# Altium schematic sheet Display.SchDoc
size B portrait
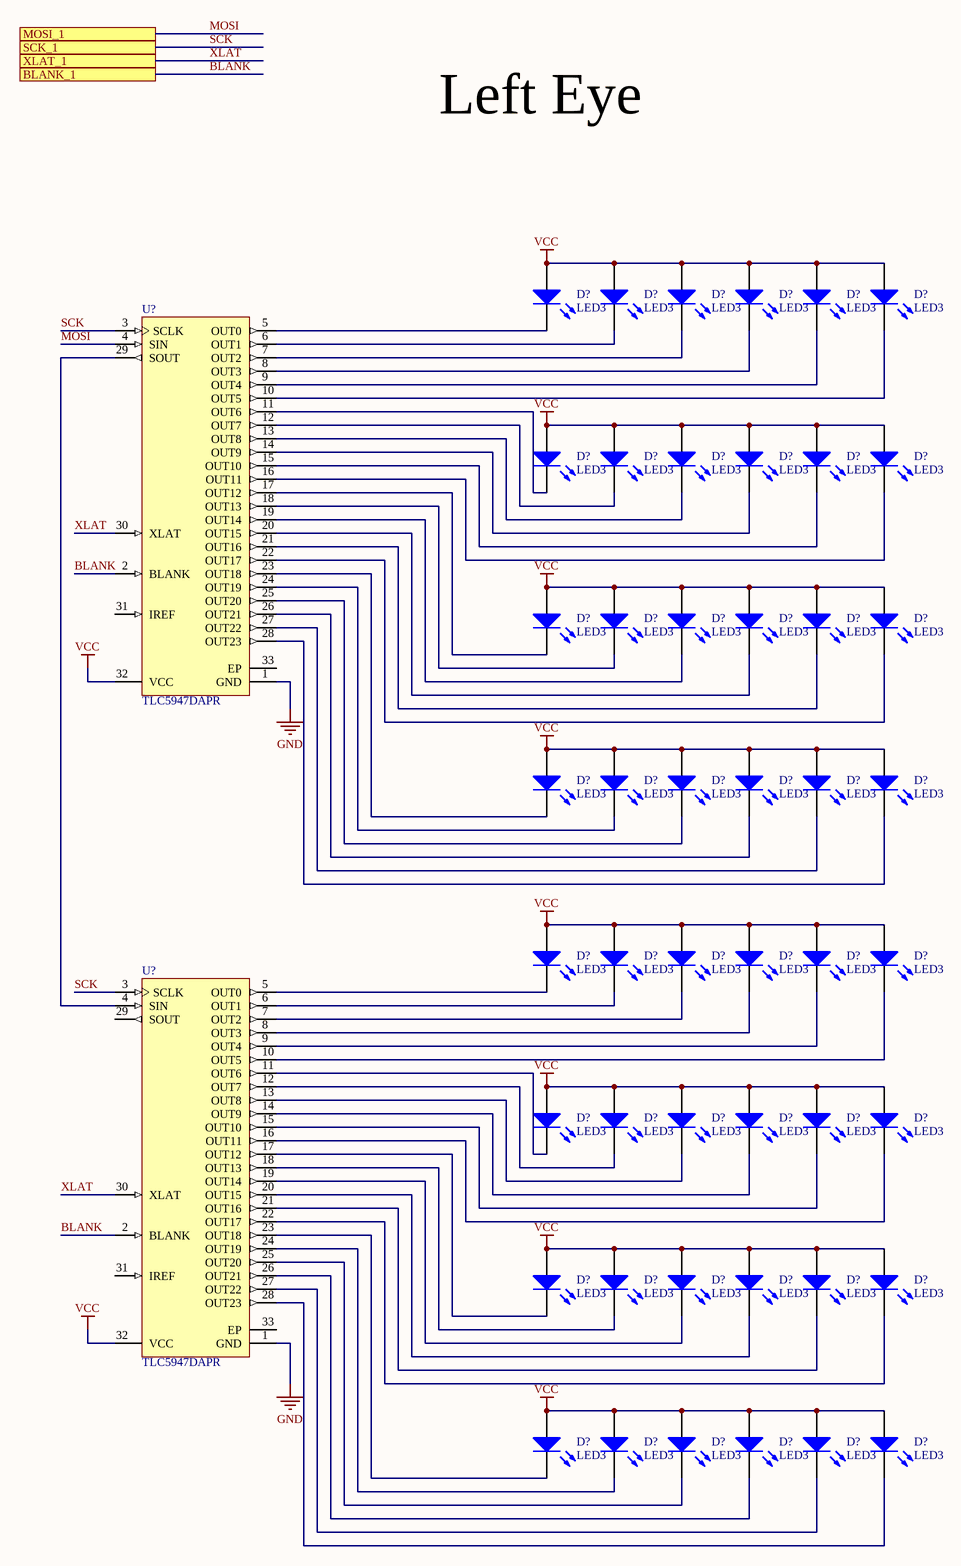
[diagram p0: Display.SchDoc]

## Parts
(Parts that share a designator on the sheet are numbered #1, #2 ... from top to bottom, then left to right.)
D?#1  LED3  [3.5X2.8X1.9]
D?#2  LED3  [3.5X2.8X1.9]
D?#3  LED3  [3.5X2.8X1.9]
D?#4  LED3  [3.5X2.8X1.9]
D?#5  LED3  [3.5X2.8X1.9]
D?#6  LED3  [3.5X2.8X1.9]
D?#7  LED3  [3.5X2.8X1.9]
D?#8  LED3  [3.5X2.8X1.9]
D?#9  LED3  [3.5X2.8X1.9]
D?#10  LED3  [3.5X2.8X1.9]
D?#11  LED3  [3.5X2.8X1.9]
D?#12  LED3  [3.5X2.8X1.9]
D?#13  LED3  [3.5X2.8X1.9]
D?#14  LED3  [3.5X2.8X1.9]
D?#15  LED3  [3.5X2.8X1.9]
D?#16  LED3  [3.5X2.8X1.9]
D?#17  LED3  [3.5X2.8X1.9]
D?#18  LED3  [3.5X2.8X1.9]
D?#19  LED3  [3.5X2.8X1.9]
D?#20  LED3  [3.5X2.8X1.9]
D?#21  LED3  [3.5X2.8X1.9]
D?#22  LED3  [3.5X2.8X1.9]
D?#23  LED3  [3.5X2.8X1.9]
D?#24  LED3  [3.5X2.8X1.9]
D?#25  LED3  [3.5X2.8X1.9]
D?#26  LED3  [3.5X2.8X1.9]
D?#27  LED3  [3.5X2.8X1.9]
D?#28  LED3  [3.5X2.8X1.9]
D?#29  LED3  [3.5X2.8X1.9]
D?#30  LED3  [3.5X2.8X1.9]
D?#31  LED3  [3.5X2.8X1.9]
D?#32  LED3  [3.5X2.8X1.9]
D?#33  LED3  [3.5X2.8X1.9]
D?#34  LED3  [3.5X2.8X1.9]
D?#35  LED3  [3.5X2.8X1.9]
D?#36  LED3  [3.5X2.8X1.9]
D?#37  LED3  [3.5X2.8X1.9]
D?#38  LED3  [3.5X2.8X1.9]
D?#39  LED3  [3.5X2.8X1.9]
D?#40  LED3  [3.5X2.8X1.9]
D?#41  LED3  [3.5X2.8X1.9]
D?#42  LED3  [3.5X2.8X1.9]
D?#43  LED3  [3.5X2.8X1.9]
D?#44  LED3  [3.5X2.8X1.9]
D?#45  LED3  [3.5X2.8X1.9]
D?#46  LED3  [3.5X2.8X1.9]
D?#47  LED3  [3.5X2.8X1.9]
D?#48  LED3  [3.5X2.8X1.9]
U?#1  TLC5947DAPR  [DAP0032A_L]
U?#2  TLC5947DAPR  [DAP0032A_L]

## Ports
BLANK_1, MOSI_1, SCK_1, XLAT_1

## Nets
GND: U?#1.1(GND) U?#2.1(GND)
VCC: D?#1.1(A) D?#2.1(A) D?#3.1(A) D?#4.1(A) D?#5.1(A) D?#6.1(A) D?#7.1(A) D?#8.1(A) D?#9.1(A) D?#10.1(A) D?#11.1(A) D?#12.1(A) D?#13.1(A) D?#14.1(A) D?#15.1(A) D?#16.1(A) D?#17.1(A) D?#18.1(A) D?#19.1(A) D?#20.1(A) D?#21.1(A) D?#22.1(A) D?#23.1(A) D?#24.1(A) D?#25.1(A) D?#26.1(A) D?#27.1(A) D?#28.1(A) D?#29.1(A) D?#30.1(A) D?#31.1(A) D?#32.1(A) D?#33.1(A) D?#34.1(A) D?#35.1(A) D?#36.1(A) D?#37.1(A) D?#38.1(A) D?#39.1(A) D?#40.1(A) D?#41.1(A) D?#42.1(A) D?#43.1(A) D?#44.1(A) D?#45.1(A) D?#46.1(A) D?#47.1(A) D?#48.1(A) U?#1.32(VCC) U?#2.32(VCC)
BLANK: U?#1.2(BLANK) U?#2.2(BLANK) ; port BLANK_1
MOSI: U?#1.4(SIN) ; port MOSI_1
SCK: U?#1.3(SCLK) U?#2.3(SCLK) ; port SCK_1
XLAT: U?#1.30(XLAT) U?#2.30(XLAT) ; port XLAT_1
NetD?#1_2: D?#1.2(K) U?#1.5(OUT0)
NetD?#2_2: D?#2.2(K) U?#1.6(OUT1)
NetD?#3_2: D?#3.2(K) U?#1.7(OUT2)
NetD?#4_2: D?#4.2(K) U?#1.8(OUT3)
NetD?#5_2: D?#5.2(K) U?#1.9(OUT4)
NetD?#6_2: D?#6.2(K) U?#1.10(OUT5)
NetD?#7_2: D?#7.2(K) U?#1.11(OUT6)
NetD?#8_2: D?#8.2(K) U?#1.12(OUT7)
NetD?#9_2: D?#9.2(K) U?#1.13(OUT8)
NetD?#10_2: D?#10.2(K) U?#1.14(OUT9)
NetD?#11_2: D?#11.2(K) U?#1.15(OUT10)
NetD?#12_2: D?#12.2(K) U?#1.16(OUT11)
NetD?#13_2: D?#13.2(K) U?#1.17(OUT12)
NetD?#14_2: D?#14.2(K) U?#1.18(OUT13)
NetD?#15_2: D?#15.2(K) U?#1.19(OUT14)
NetD?#16_2: D?#16.2(K) U?#1.20(OUT15)
NetD?#17_2: D?#17.2(K) U?#1.21(OUT16)
NetD?#18_2: D?#18.2(K) U?#1.22(OUT17)
NetD?#19_2: D?#19.2(K) U?#1.23(OUT18)
NetD?#20_2: D?#20.2(K) U?#1.24(OUT19)
NetD?#21_2: D?#21.2(K) U?#1.25(OUT20)
NetD?#22_2: D?#22.2(K) U?#1.26(OUT21)
NetD?#23_2: D?#23.2(K) U?#1.27(OUT22)
NetD?#24_2: D?#24.2(K) U?#1.28(OUT23)
NetD?#25_2: D?#25.2(K) U?#2.5(OUT0)
NetD?#26_2: D?#26.2(K) U?#2.6(OUT1)
NetD?#27_2: D?#27.2(K) U?#2.7(OUT2)
NetD?#28_2: D?#28.2(K) U?#2.8(OUT3)
NetD?#29_2: D?#29.2(K) U?#2.9(OUT4)
NetD?#30_2: D?#30.2(K) U?#2.10(OUT5)
NetD?#31_2: D?#31.2(K) U?#2.11(OUT6)
NetD?#32_2: D?#32.2(K) U?#2.12(OUT7)
NetD?#33_2: D?#33.2(K) U?#2.13(OUT8)
NetD?#34_2: D?#34.2(K) U?#2.14(OUT9)
NetD?#35_2: D?#35.2(K) U?#2.15(OUT10)
NetD?#36_2: D?#36.2(K) U?#2.16(OUT11)
NetD?#37_2: D?#37.2(K) U?#2.17(OUT12)
NetD?#38_2: D?#38.2(K) U?#2.18(OUT13)
NetD?#39_2: D?#39.2(K) U?#2.19(OUT14)
NetD?#40_2: D?#40.2(K) U?#2.20(OUT15)
NetD?#41_2: D?#41.2(K) U?#2.21(OUT16)
NetD?#42_2: D?#42.2(K) U?#2.22(OUT17)
NetD?#43_2: D?#43.2(K) U?#2.23(OUT18)
NetD?#44_2: D?#44.2(K) U?#2.24(OUT19)
NetD?#45_2: D?#45.2(K) U?#2.25(OUT20)
NetD?#46_2: D?#46.2(K) U?#2.26(OUT21)
NetD?#47_2: D?#47.2(K) U?#2.27(OUT22)
NetD?#48_2: D?#48.2(K) U?#2.28(OUT23)
NetU?#1_29: U?#1.29(SOUT) U?#2.4(SIN)

Not connected (* = marked no-connect by the designer): U?#1 31(IREF) 33(EP); U?#2 29(SOUT) 31(IREF) 33(EP)

## Notes on the sheet
- Left Eye

## Library data of the parts
D?#1-D?#48 = LED3: Typical BLUE SiC LED; Published: 8-Jun-2000; LatestRevisionDate: 17-Dec-2003; LatestRevisionNote: PCB Footprint replaced.; DatasheetVersion: 16-Apr-2002; PackageVersion: 16-Apr-2002; PackageReference: 3.5X2.8X1.9; Publisher: Altium Limited; PackageDescription: SM LED; 2 C-Bend Leads; Body 3.5 x 2.8 x 1.9 mm, inc leads (LxWxH typ)
U?#1 U?#2 = CMP-0388-00089-2: 24-Channel, 12-Bit PWM LED Driver with Internal Oscillator, 3 to 5.5 V, -40 to 85 degC, 32-pin SOP (DAP32), Green (RoHS & no Sb/Br); Manufacturer: Texas Instruments; Vin(Min)(V): 3; Vin(Max)(V): 5.5; Rating: Catalog; Code_JEDEC: MO-153; Mounting Technology: Surface Mount; SubFamily: LED Driver; ComponentLink3URL: http://www.ti.com/litv/pdf/mpds380; Eco-Plan: Green (RoHS & no Sb/Br); PartNumber: TLC5947DAPR; DatasheetVersion: SBVS114A; ComponentLink2URL: http://www.ti.com/general/docs/lit/getliterature.tsp?genericPartNumber=TLC5947&fileType=pdf; ComponentLink3Description: Package Specification; PackageVersion: 4073257-4/E; ComponentLink1URL: http://www.ti.com/; PackageReference: DAP0032A; PackageDescription: 32-pin Plastic Small Outline, Body 11 x 6.1 mm, Pitch 0.65 mm; ComponentLink2Description: Datasheet; ComponentLink1Description: Manufacturer URL